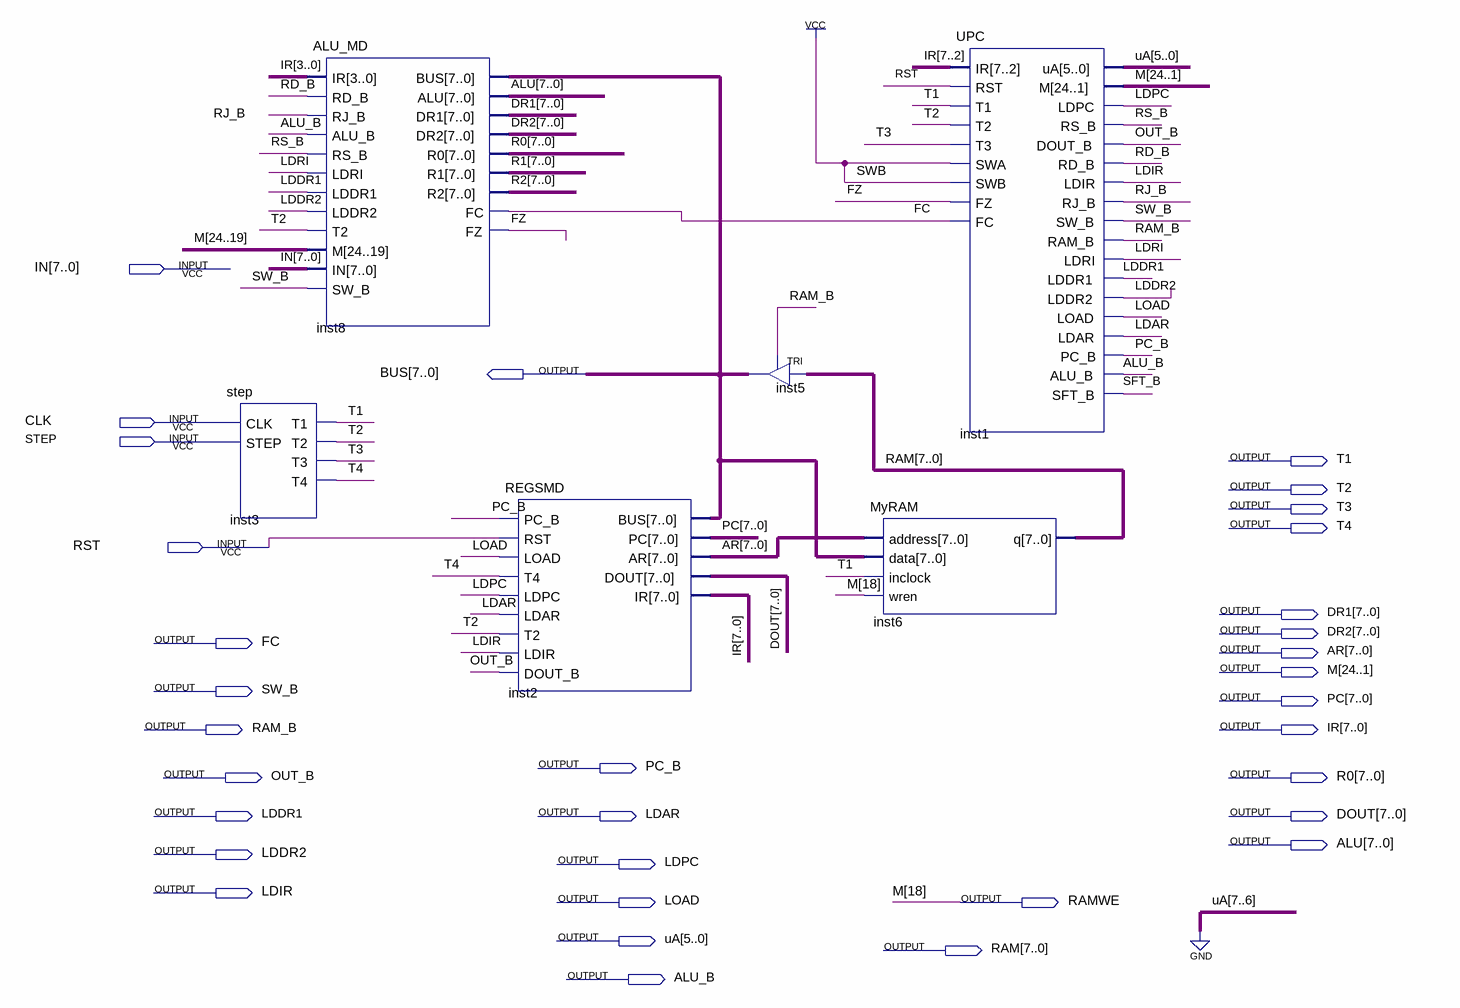
[diagram p0: schematic sheet]
// Quartus schematic MYCPU.bdf as structural Verilog: 6 symbols, 33 pins
module MYCPU (
  input  [7:0] IN,
  input  CLK,
  input  STEP,
  input  RST,
  output [7:0] BUS,
  output T1,
  output T2,
  output T3,
  output T4,
  output [7:0] DR1,
  output [7:0] DR2,
  output FC,
  output [7:0] AR,
  output [24:1] M,
  output SW_B,
  output [7:0] PC,
  output RAM_B,
  output [7:0] IR,
  output PC_B,
  output OUT_B,
  output [7:0] R0,
  output LDDR1,
  output LDAR,
  output [7:0] DOUT,
  output [7:0] ALU,
  output LDDR2,
  output LDPC,
  output LDIR,
  output LOAD,
  output RAMWE,
  output [5:0] uA,
  output [7:0] RAM,
  output ALU_B
);

  wire FZ, LDRI, RD_B, RJ_B, RS_B, SFT_B;
  wire [7:0] R1, R2;

  step inst3 (.CLK(CLK), .STEP(STEP), .T1(T1), .T2(T2), .T3(T3), .T4(T4));
  ALU_MD inst8 (
    .IR(IR[3:0]), .RD_B(RD_B), .RJ_B(RJ_B), .ALU_B(ALU_B), .RS_B(RS_B), .LDRI(LDRI), .LDDR1(LDDR1),
    .LDDR2(LDDR2), .T2(T2), .M(M[24:19]), .IN(IN), .SW_B(SW_B), .BUS(BUS), .ALU(ALU), .DR1(DR1), .DR2(DR2),
    .R0(R0), .R1(R1), .R2(R2), .FC(FC), .FZ(FZ));
  REGSMD inst2 (
    .PC_B(PC_B), .RST(RST), .LOAD(LOAD), .T4(T4), .LDPC(LDPC), .LDAR(LDAR), .T2(T2), .LDIR(LDIR),
    .DOUT_B(OUT_B), .BUS(BUS), .PC(PC), .AR(AR), .DOUT(DOUT), .IR(IR));
  TRI inst5[7:0] (.IN(RAM), .OE(RAM_B), .OUT(BUS));
  MyRAM inst6 (.address(AR), .data(BUS), .inclock(T1), .wren(M[18]), .q(RAM));
  UPC inst1 (
    .IR(IR[7:2]), .RST(RST), .T1(T1), .T2(T2), .T3(T3), .SWA(1'b1), .SWB(1'b1), .FZ(FZ), .FC(FC), .uA(uA),
    .M(M), .LDPC(LDPC), .RS_B(RS_B), .DOUT_B(OUT_B), .RD_B(RD_B), .LDIR(LDIR), .RJ_B(RJ_B), .SW_B(SW_B),
    .RAM_B(RAM_B), .LDRI(LDRI), .LDDR1(LDDR1), .LDDR2(LDDR2), .LOAD(LOAD), .LDAR(LDAR), .PC_B(PC_B),
    .ALU_B(ALU_B), .SFT_B(SFT_B));

  assign RAMWE = M[18];
endmodule
